# EAGLE schematic ADC schem (EAGLE 9.5.2)
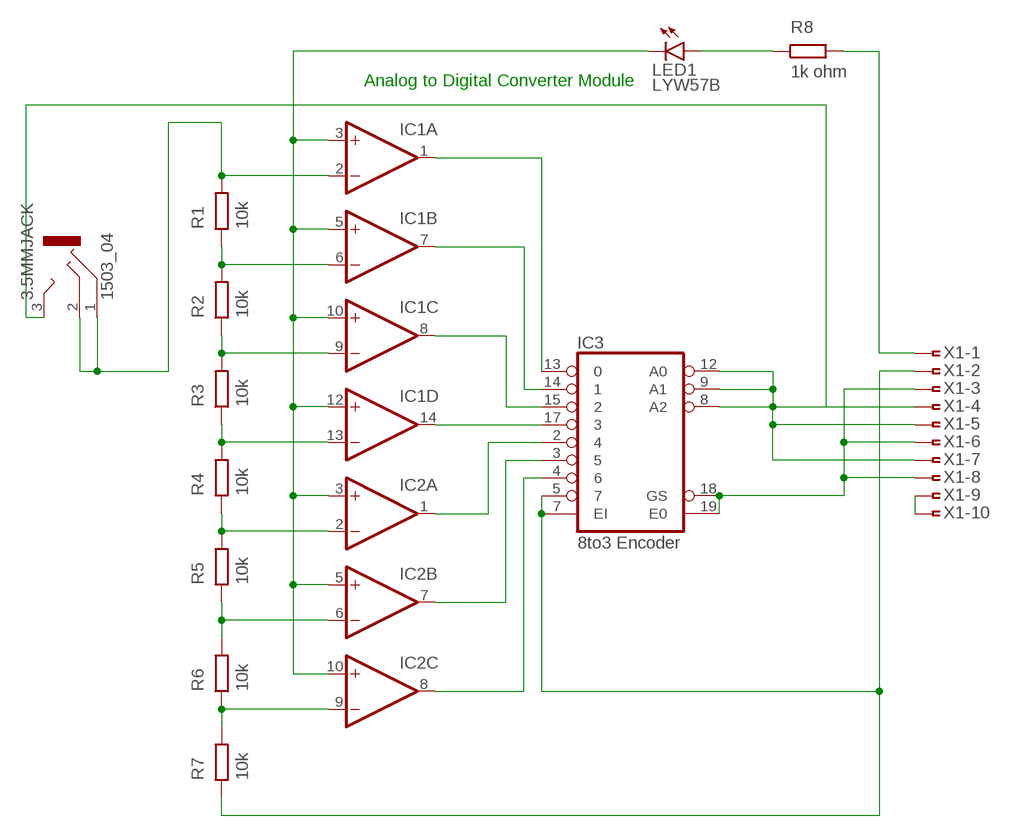
[diagram p0: schematic, sheet 1]

## Parts
3.5MMJACK  1503_04  [1503_04]
IC1  4AMP_P4+11D  [SO14]
IC2  4AMP_P4+11D  [SO14]
IC3  8to3 Encoder  74LS348FK  [LCC20]
LED1  LYW57B  [W57B]
R1  10k  R  (no package)
R2  10k  R  (no package)
R3  10k  R  (no package)
R4  10k  R  (no package)
R5  10k  R  (no package)
R6  10k  R  (no package)
R7  10k  R  (no package)
R8  1k ohm  R  (no package)
X1  FSIDE-10  [FSIDE-10]

## Nets
N$1: IC1.6(B:-IN) R1.1 R2.2
N$2: IC1.9(C:-IN) R2.1 R3.2
N$3: IC1.13(D:-IN) R3.1 R4.2
N$4: IC2.2(A:-IN) R4.1 R5.2
N$5: IC2.6(B:-IN) R5.1 R6.2
N$6: IC2.9(C:-IN) R6.1 R7.2
N$7: IC3.5 IC3.7(EI) R7.1 X1.2
N$8: IC1.1(A:OUT) IC3.13
N$9: IC1.7(B:OUT) IC3.14
N$10: IC1.8(C:OUT) IC3.15
N$11: IC1.14(D:OUT) IC3.17
N$12: IC2.1(A:OUT) IC3.2
N$13: IC2.7(B:OUT) IC3.3
N$14: IC2.8(C:OUT) IC3.4
N$15: 3.5MMJACK.1 3.5MMJACK.2 IC1.2(A:-IN) R1.2
N$16: IC1.3(A:+IN) IC1.5(B:+IN) IC1.10(C:+IN) IC1.12(D:+IN) IC2.3(A:+IN) IC2.5(B:+IN) IC2.10(C:+IN) LED1.C LED1.C@1(C) LED1.C@2(C) LED1.C@3(C) LED1.C@4(C) LED1.C@5(C)
N$17: R8.2 X1.1
N$18: LED1.A R8.1
N$19: 3.5MMJACK.3 IC3.8(A2) IC3.9(A1) IC3.12(A0) X1.4 X1.5 X1.7
N$20: IC3.18(GS) IC3.19(E0) X1.3 X1.6 X1.8
N$22: X1.9 X1.10
Unconnected: IC2.12(D:+IN) IC2.13(D:-IN) IC2.14(D:OUT)

## Notes on the sheet
- Analog to Digital Converter Module

## Power pins joined to a net without a drawn wire
GND: IC3.10(GND)
V+: IC1.4(P:V+) IC2.4(P:V+)
V-: IC1.11(P:V-) IC2.11(P:V-)
VCC: IC3.20(VCC)

## Library data of the parts
3.5MMJACK = con-lumberg:1503_04: Jack connectors according to JISC 6560, 3.5 mm, IP 57 Klinkensteckverbinder nach JISC 6560, 3,5 mm, IP 57 Source: http://www.lumberg.com/Produkte/PDFs/1503_04.pdf; OC_FARNELL: 1216981; OC_NEWARK: unknown
IC1 IC2 = linear:4AMP_P4+11: OP AMP
IC3 = 74xx-eu:74*348: 8-to 3 line PRIORITY ENCODER, 3-state
LED1 = led:*W57B: Golden Dragon® 1 Watt LED Place heat sink pads of cathode with INVOKE Source: www.osram-os.com la_ly_w57b.pdf
R1-R8 = ngspice-simulation:R: RESISTOR
X1 = con-amp:FSIDE-10: AMP connector